# Altium schematic sheet MCU.SchDoc
size A4
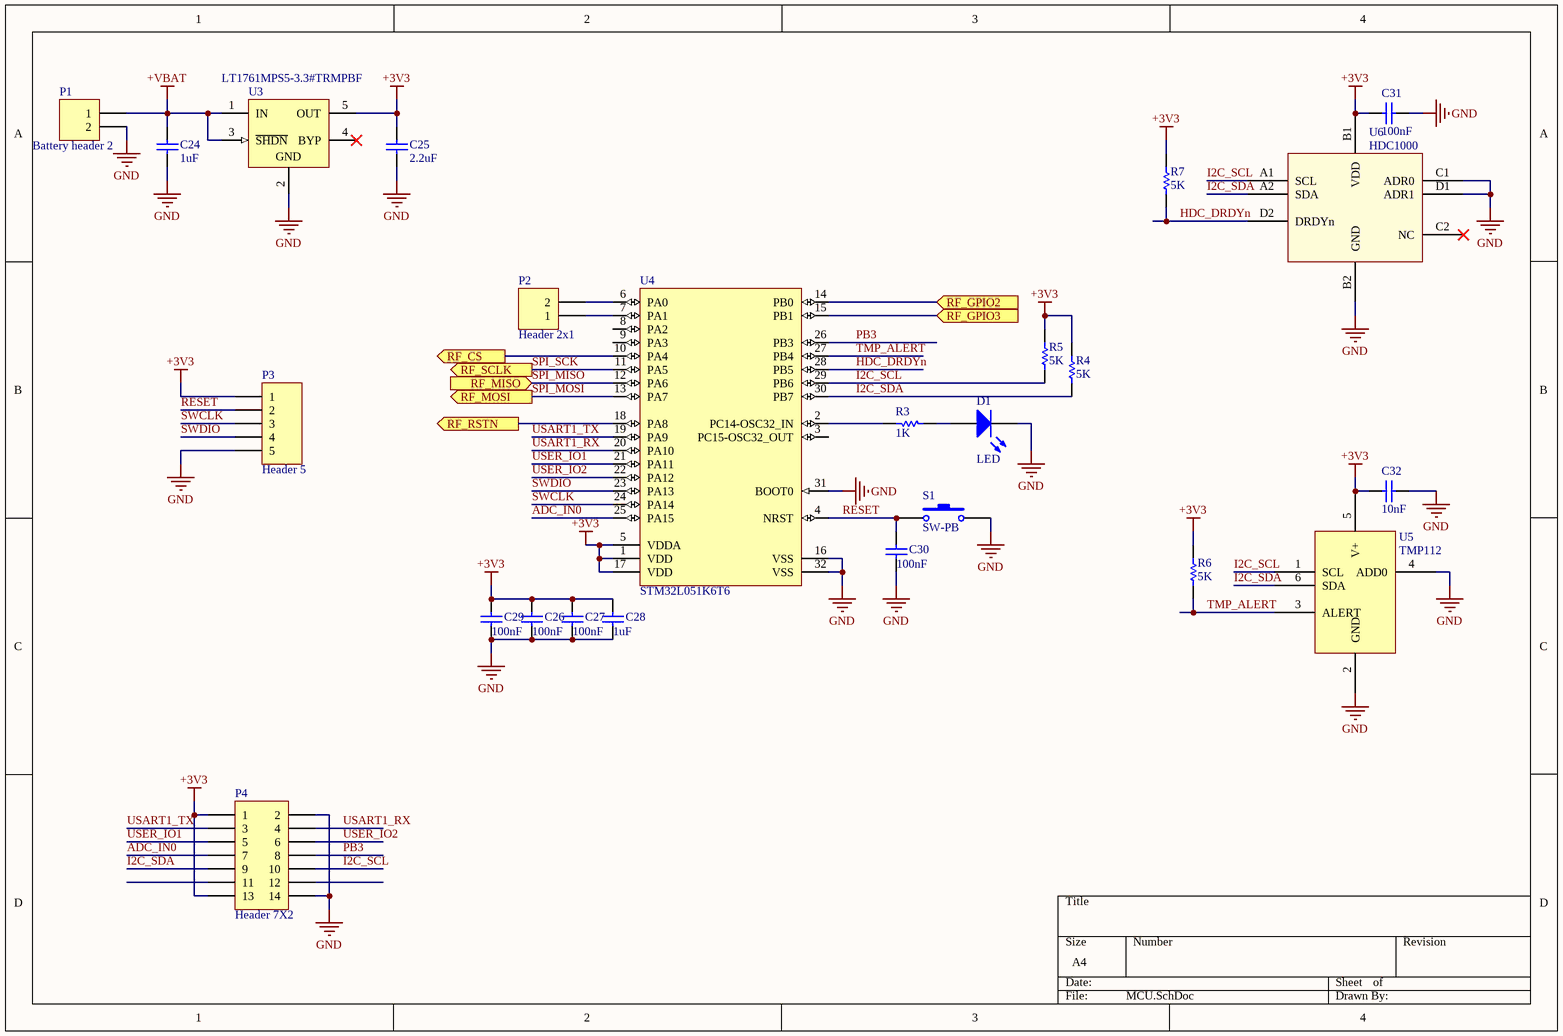
[diagram p0: MCU.SchDoc]

## Parts
C24  value 1uF  [0402_ipc]  (hidden comment: Cap)
C25  value 2.2uF  [0402_ipc]  (hidden comment: Cap)
C26  value 100nF  [0402_ipc]  (hidden comment: Cap)
C27  value 100nF  [0402_ipc]  (hidden comment: Cap)
C28  value 1uF  [0402_ipc]  (hidden comment: Cap)
C29  value 100nF  [0402_ipc]  (hidden comment: Cap)
C30  value 100nF  [0402_ipc]  (hidden comment: Cap)
C31  value 100nF  [0402_ipc]  (hidden comment: Cap)
C32  value 10nF  [0402_ipc]  (hidden comment: Cap)
D1  LED  [LED_5MM]
P1  Battery header 2  [HDR1X2]
P2  Header 2x1  [HDR1X2_100mil]
P3  Header 5  [HDR1X5]
P4  Header 7X2  [HDR2X7]
R3  value 1K  [0805_IPC]  (hidden comment: Res)
R4  value 5K  [0402_ipc]  (hidden comment: Res)
R5  value 5K  [0402_ipc]  (hidden comment: Res)
R6  value 5K  [0402_ipc]  (hidden comment: Res)
R7  value 5K  [0402_ipc]  (hidden comment: Res)
S1  SW-PB  [SW_PB]
U3  LT1761MPS5-3.3#TRMPBF  [LT-S5-5-TSOT-23_M]
U4  STM32L051K6T6  [STM-LQFP32_M]
U5  TMP112  [TMP112]
U6  HDC1000  [HDC1000]

## Ports
RF_CS (out), RF_GPIO2 (in), RF_GPIO3 (in), RF_MISO (in), RF_MOSI (out), RF_RSTN (out), RF_SCLK (out)

## Nets
+3V3: C25.2 C26.2 C27.2 C28.2 C29.2 C31.2 C32.2 P3.1 P4.1 P4.13 R4.2 R5.2 R6.2 R7.2 U3.5(OUT) U4.1(VDD) U4.5(VDDA) U4.17(VDD) U5.5(V+) U6.B1(VDD)
+VBAT: C24.2 P1.1 U3.1(IN) U3.3(~{SHDN})
GND: C24.1 C25.1 C26.1 C27.1 C28.1 C29.1 C30.1 C31.1 C32.1 D1.2(K) P1.2 P3.5 P4.2 P4.14 S1.2 U3.2(GND) U4.16(VSS) U4.31(BOOT0) U4.32(VSS) U5.2(GND) U5.4(ADD0) U6.B2(GND) U6.C1(ADR0) U6.D1(ADR1)
ADC_IN0: P4.7 U4.25(PA15)
HDC_DRDYn: R7.1 U4.28(PB5) U6.D2(DRDYn)
I2C_SCL: P4.10 R5.1 U4.29(PB6) U5.1(SCL) U6.A1(SCL)
I2C_SDA: P4.9 R4.1 U4.30(PB7) U5.6(SDA) U6.A2(SDA)
PB3: P4.8 U4.26(PB3)
RESET: C30.2 P3.2 S1.1 U4.4(NRST)
RF_CS: U4.10(PA4) ; port RF_CS
RF_GPIO2: U4.14(PB0) ; port RF_GPIO2
RF_GPIO3: U4.15(PB1) ; port RF_GPIO3
RF_RSTN: U4.18(PA8) ; port RF_RSTN
SPI_MISO: U4.12(PA6) ; port RF_MISO
SPI_MOSI: U4.13(PA7) ; port RF_MOSI
SPI_SCK: U4.11(PA5) ; port RF_SCLK
SWCLK: P3.3 U4.24(PA14)
SWDIO: P3.4 U4.23(PA13)
TMP_ALERT: R6.1 U4.27(PB4) U5.3(ALERT)
USART1_RX: P4.4 U4.20(PA10)
USART1_TX: P4.3 U4.19(PA9)
USER_IO1: P4.5 U4.21(PA11)
USER_IO2: P4.6 U4.22(PA12)
NetD1_1: D1.1(A) R3.2
NetP2_1: P2.1 U4.7(PA1)
NetP2_2: P2.2 U4.6(PA0)
NetR3_1: R3.1 U4.2(PC14-OSC32_IN)

Not connected (* = marked no-connect by the designer): P4 11 12; U3 4(BYP)*; U4 3(PC15-OSC32_OUT) 8(PA2) 9(PA3); U6 C2(NC)*

## Library data of the parts
C24-C32 = Cap: Capacitor; PackageReference: RAD-0.3; Publisher: Altium Limited
D1 = LED: Typical INFRARED GaAs LED; Published: 8-Jun-2000; LatestRevisionDate: 08-Jul-2005; LatestRevisionNote: Mech Layer 1 removed.; PackageReference: LED-0; Publisher: Altium Limited; PackageDescription: LED; 2 Leads
P3 = Header 5: Header, 5-Pin; LatestRevisionDate: 17-Jul-2002; LatestRevisionNote: Re-released for DXP Platform.; Publisher: Altium Limited
P4 = Header 7X2: Header, 7-Pin, Dual row; LatestRevisionDate: 17-Jul-2002; LatestRevisionNote: Re-released for DXP Platform.; Publisher: Altium Limited
R3-R7 = Res: Resistor; PackageReference: AXIAL-0.3; PackageDescription: Axial Device, Thru-Hole; 2 Leads; 0.3 in Pin Spacing
S1 = SW-PB: Switch; Published: 24-Mar-1999; LatestRevisionDate: 17-Jul-2002; LatestRevisionNote: Re-released for DXP Platform.; PackageReference: SPST-2; Publisher: Altium Limited; PackageDescription: Switch; 2 Leads
U3 = CMP-0476-01317-1: 100 mA, Low Noise, LDO Micropower Regulator, 1.8 to 20 V Vin, 3.3 V Vout, 5-pin SOT23 (S5-5), -55 to 125 degC, Pb-Free, Mini Tape and Reel; Manufacturer: Linear Technology; Iout(mA): 100; Discrete Pass Element: no; PSRR(dB): 65; Shutdown Current(uA): 1; Output Voltage: 3.3 V; Isupply(mA): 0.02; Vin Min(V): 1.8; Dropout Voltage(V): 0.3; Vin Max(V): 20; Mounting Technology: Surface Mount; Number of Outputs: 1; PackageVersion: Jun-10; PartNumber: LT1761MPS5-3.3#TRMPBF; ComponentLink1Description: Manufacturer URL; ComponentLink3URL: http://cds.linear.com/docs/en/packaging/SOT_5_05-08-1635.pdf; ComponentLink3Description: Package Specification; RoHS: TRUE; Packing: Mini Tape and Reel; PackageDescription: 5-Pin Plastic TSOT-23, Body 1.63 x 2.90 mm, Pitch 0.95 mm; Code_JEDEC: MO-193; ComponentLink2Description: Datasheet; ComponentLink1URL: http://www.linear.com/; PackageReference: S5-5; DatasheetVersion: Rev. F; Noise(uV): 20; ComponentLink2URL: http://cds.linear.com/docs/en/datasheet/1761sff.pdf
U4 = CMP-1341-00001-1: Access Line Ultra-Low-Power ADC, 32 Bit MCU ARM, 32 kB Flash, 8 kB SRAM, 2 kB EEPROM, -40 to 85 degC, 32-Pin LQFP, Tray; Manufacturer: STMicroelectronics; RAM: 8 kB; Comparators: 2; Data EEPROM: 2 kB; GPIOs: 25; Flash: 32 kB; Temperature Range: -40 to 85 degC; ComponentLink1Description: Manufacturer URL; Packing: Tray; DatasheetVersion: Rev. 4; ComponentLink3URL: http://www.st.com/st-web-ui/static/active/en/resource/technical/document/datasheet/DM00108219.pdf; PartNumber: STM32L051K6T6; ComponentLink1URL: http://www.st.com/; ComponentLink2URL: http://www.st.com/st-web-ui/static/active/en/resource/technical/document/datasheet/DM00108219.pdf; ComponentLink2Description: Datasheet; PackageDescription: 32-Pin Low-Profile Quad Flat Package, Body 7 x 7 mm, Pitch 0.8 mm; ComponentLink3Description: Package Specification; Mounting Technology: Surface Mount
P1 = Battery header 2: LatestRevisionDate: 17-Jul-2002; LatestRevisionNote: Re-released for DXP Platform.; Publisher: Altium Limited